# Altium schematic sheet PIC32MX_circuit.SchDoc
size A4
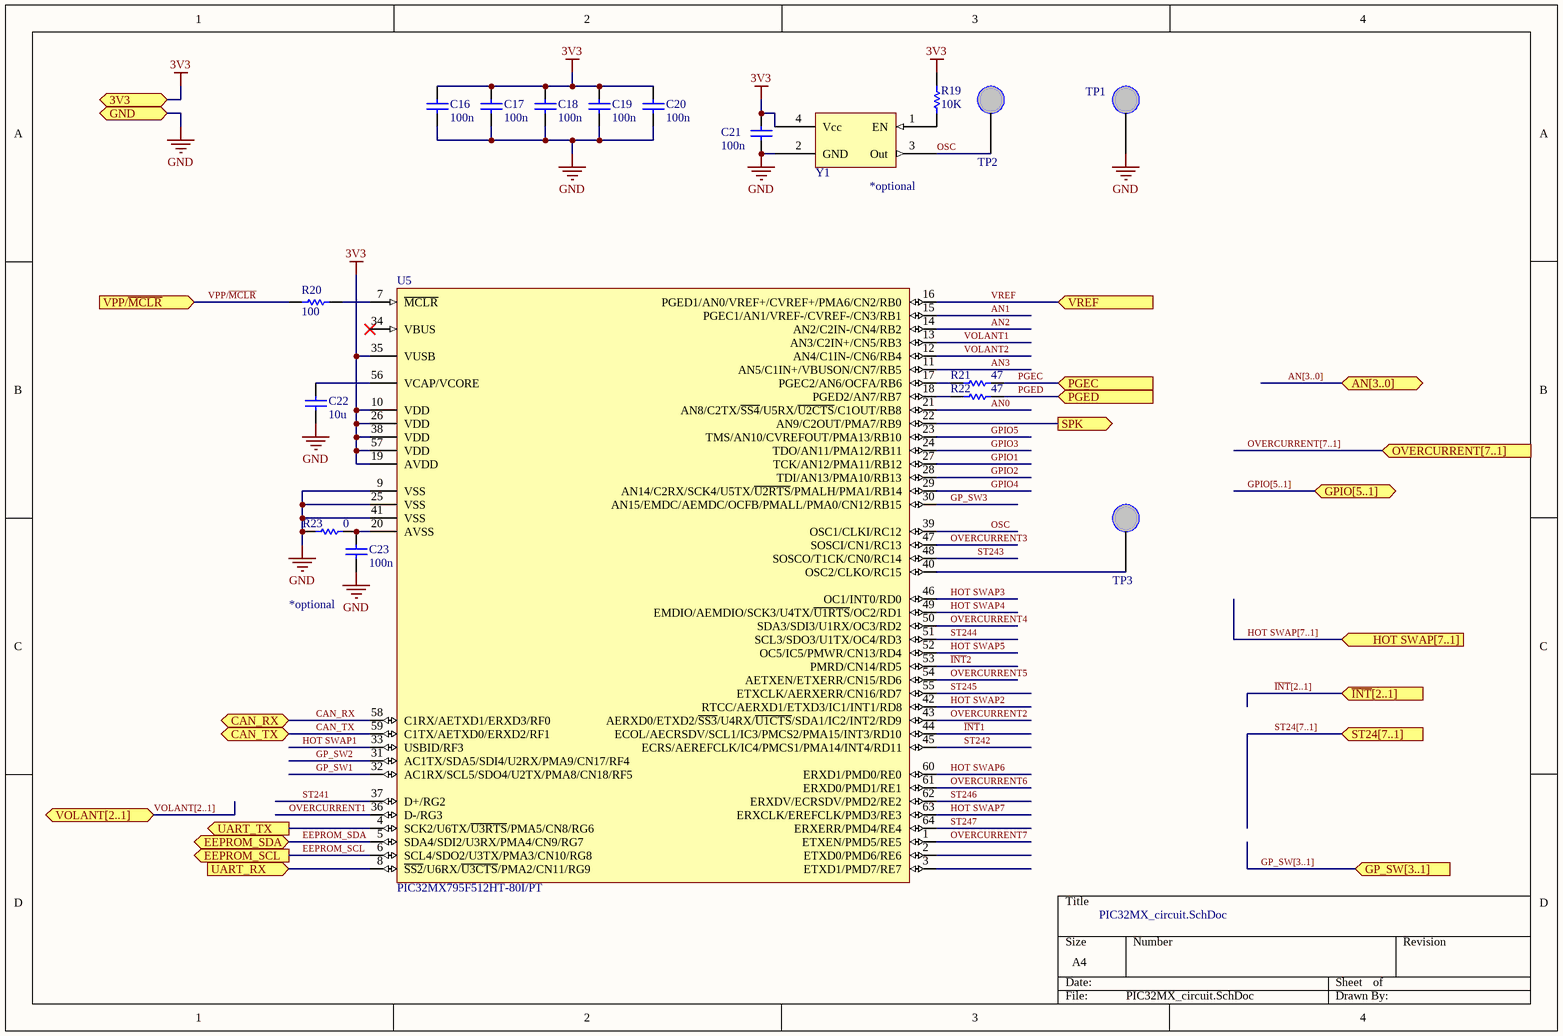
[diagram p0: PIC32MX_circuit.SchDoc]

## Parts
C16  value 100n  [CS-0603]  (hidden comment: CS - CAPACITOR)
C17  value 100n  [CS-0603]  (hidden comment: CS - CAPACITOR)
C18  value 100n  [CS-0603]  (hidden comment: CS - CAPACITOR)
C19  value 100n  [CS-0603]  (hidden comment: CS - CAPACITOR)
C20  value 100n  [CS-0603]  (hidden comment: CS - CAPACITOR)
C21  value 100n  [CS-0603]  (hidden comment: CS - CAPACITOR)
C22  value 10u  [CS-0603]  (hidden comment: CS - CAPACITOR)
C23  value 100n  [CS-0603]  (hidden comment: CS - CAPACITOR)
R19  value 10K  [RS-0603]  (hidden comment: RS - RESISTOR)
R20  value 100  [RS-0603]  (hidden comment: RS - RESISTOR)
R21  value 47  [RS-0603]  (hidden comment: RS - RESISTOR)
R22  value 47  [RS-0603]  (hidden comment: RS - RESISTOR)
R23  value 0  [RS-0603]  (hidden comment: RS - RESISTOR)
TP1  5003K  [TP - VERTICAL]  (value not drawn)
TP2  5003K  [TP - VERTICAL]  (value not drawn)
TP3  5003K  [TP - VERTICAL]  (value not drawn)
U5  PIC32MX795F512HT-80I/PT  [IC-TQFP-64]
Y1  OSC - CB3LV  [OSC-CB3LV]  (value not drawn)

## Ports
3V3, AN[3..0] (bidir), CAN_RX, CAN_TX, EEPROM_SCL (out), EEPROM_SDA (bidir), GND, GP_SW[3..1] (in), GPIO[5..1] (bidir), HOT SWAP[7..1] (in), OVERCURRENT[7..1] (in), PGEC (in), PGED (in), SPK (out), ST24[7..1] (in), UART_RX (in), UART_TX (out), VOLANT[2..1] (bidir), VPP/~{MCLR} (in), VREF (in), ~{INT}[2..1] (in)

## Nets
3V3: C16.2 C17.2 C18.2 C19.2 C20.2 C21.2 R19.2 U5.10(VDD) U5.19(AVDD) U5.26(VDD) U5.35(VUSB) U5.38(VDD) U5.57(VDD) Y1.4(Vcc) ; port 3V3
GND: C16.1 C17.1 C18.1 C19.1 C20.1 C21.1 C22.1 C23.1 R23.2 TP1.1 U5.9(VSS) U5.25(VSS) U5.41(VSS) Y1.2(GND) ; port GND
AN0: U5.21(AN8/C2TX/~{SS4}/U5RX/~{U2CTS}/C1OUT/RB8)
AN1: U5.15(PGEC1/AN1/VREF-/CVREF-/CN3/RB1)
AN2: U5.14(AN2/C2IN-/CN4/RB2)
AN3: U5.11(AN5/C1IN+/VBUSON/CN7/RB5)
CAN_RX: U5.58(C1RX/AETXD1/ERXD3/RF0) ; port CAN_RX
CAN_TX: U5.59(C1TX/AETXD0/ERXD2/RF1) ; port CAN_TX
EEPROM_SCL: U5.6(SCL4/SDO2/U3TX/PMA3/CN10/RG8) ; port EEPROM_SCL
EEPROM_SDA: U5.5(SDA4/SDI2/U3RX/PMA4/CN9/RG7) ; port EEPROM_SDA
GP_SW1: U5.32(AC1RX/SCL5/SDO4/U2TX/PMA8/CN18/RF5)
GP_SW2: U5.31(AC1TX/SDA5/SDI4/U2RX/PMA9/CN17/RF4)
GP_SW3: U5.30(AN15/EMDC/AEMDC/OCFB/PMALL/PMA0/CN12/RB15)
GPIO1: U5.27(TCK/AN12/PMA11/RB12)
GPIO2: U5.28(TDI/AN13/PMA10/RB13)
GPIO3: U5.24(TDO/AN11/PMA12/RB11)
GPIO4: U5.29(AN14/C2RX/SCK4/U5TX/~{U2RTS}/PMALH/PMA1/RB14)
GPIO5: U5.23(TMS/AN10/CVREFOUT/PMA13/RB10)
HOT SWAP1: U5.33(USBID/RF3)
HOT SWAP2: U5.42(RTCC/AERXD1/ETXD3/IC1/INT1/RD8)
HOT SWAP3: U5.46(OC1/INT0/RD0)
HOT SWAP4: U5.49(EMDIO/AEMDIO/SCK3/U4TX/~{U1RTS}/OC2/RD1)
HOT SWAP5: U5.52(OC5/IC5/PMWR/CN13/RD4)
HOT SWAP6: U5.60(ERXD1/PMD0/RE0)
HOT SWAP7: U5.63(ERXCLK/EREFCLK/PMD3/RE3)
~{INT}1: U5.44(ECOL/AECRSDV/SCL1/IC3/PMCS2/PMA15/INT3/RD10)
~{INT}2: U5.53(PMRD/CN14/RD5)
OSC: TP2.1 U5.39(OSC1/CLKI/RC12) Y1.3(Out)
OVERCURRENT1: U5.36(D-/RG3)
OVERCURRENT2: U5.43(AERXD0/ETXD2/~{SS3}/U4RX/~{U1CTS}/SDA1/IC2/INT2/RD9)
OVERCURRENT3: U5.47(SOSCI/CN1/RC13)
OVERCURRENT4: U5.50(SDA3/SDI3/U1RX/OC3/RD2)
OVERCURRENT5: U5.54(AETXEN/ETXERR/CN15/RD6)
OVERCURRENT6: U5.61(ERXD0/PMD1/RE1)
OVERCURRENT7: U5.1(ETXEN/PMD5/RE5)
PGEC: R21.1 ; port PGEC
PGED: R22.1 ; port PGED
SPK: U5.22(AN9/C2OUT/PMA7/RB9) ; port SPK
ST241: U5.37(D+/RG2)
ST242: U5.45(ECRS/AEREFCLK/IC4/PMCS1/PMA14/INT4/RD11)
ST243: U5.48(SOSCO/T1CK/CN0/RC14)
ST244: U5.51(SCL3/SDO3/U1TX/OC4/RD3)
ST245: U5.55(ETXCLK/AERXERR/CN16/RD7)
ST246: U5.62(ERXDV/ECRSDV/PMD2/RE2)
ST247: U5.64(ERXERR/PMD4/RE4)
UART_RX: U5.8(~{SS2}/U6RX/~{U3CTS}/PMA2/CN11/RG9) ; port UART_RX
UART_TX: U5.4(SCK2/U6TX/~{U3RTS}/PMA5/CN8/RG6) ; port UART_TX
VOLANT1: U5.13(AN3/C2IN+/CN5/RB3)
VOLANT2: U5.12(AN4/C1IN-/CN6/RB4)
VPP/~{MCLR}: R20.2 ; port VPP/~{MCLR}
VREF: U5.16(PGED1/AN0/VREF+/CVREF+/PMA6/CN2/RB0) ; port VREF
NetC22_2: C22.2 U5.56(VCAP/VCORE)
NetC23_2: C23.2 R23.1 U5.20(AVSS)
NetR19_1: R19.1 Y1.1(EN)
NetR20_1: R20.1 U5.7(~{MCLR})
NetR21_2: R21.2 U5.17(PGEC2/AN6/OCFA/RB6)
NetR22_2: R22.2 U5.18(PGED2/AN7/RB7)
NetTP3_1: TP3.1 U5.40(OSC2/CLKO/RC15)

Not connected (* = marked no-connect by the designer): U5 2(ETXD0/PMD6/RE6) 3(ETXD1/PMD7/RE7) 34(VBUS)*

## Buses and harness runs
bus AN[3..0] = port AN[3..0]
bus GP_SW[3..1] = port GP_SW[3..1]
bus GPIO[5..1] = port GPIO[5..1]
bus HOT SWAP[7..1] = port HOT SWAP[7..1]
bus OVERCURRENT[7..1] = port OVERCURRENT[7..1]
bus ST24[7..1] = port ST24[7..1]
bus VOLANT[2..1] = port VOLANT[2..1]
bus ~{INT}[2..1] = port ~{INT}[2..1]

## Notes on the sheet
- (near Y1) *optional
- *optional

## Library data of the parts
C16-C23 = CS - CAPACITOR: TOLERANCE: 10%; VOLTAGE: 16V; Supplier 1: *; (FIELD A): *; (FLIED C): *; (FIELD B): *; Manufacturer: *
  C16-C21 C23: Supplier Part Number 1: 490-1532-1-ND
  C22: Supplier Part Number 1: *
R19-R23 = RS - RESISTOR: TOLERANCE: RES TOL; POWER: RES POWER; Supplier Part Number 1: *; Supplier 1: *; (FIELD A): *; (FLIED C): *; (FIELD B): *; Manufacturer: *
TP1-TP3 = TP - Test point vertical: (FIELD A): *; (FIELD B): *; (FIELD C): *; Manufacturer: *; Supplier 1: Newark; Supplier Part Number 1: 62W5140
U5 = IC - PIC32MX795F512HT-80I/PT: Manufacturer: Microchip; (FLIED A): *; (FLIED B): *; (FLIED C): *; Supplier 1: Digi-Key; Supplier Part Number 1: PIC32MX795F512H-80I/PT-ND
Y1 = OSC - CB3LV: Oscillator; Supplier 1: Digi-Key; Supplier Part Number 1: CTX264LVCT-ND; (FLIED A): *; (FLIED B): *; (FLIED C): *; Manufacturer: *; Frequency: *